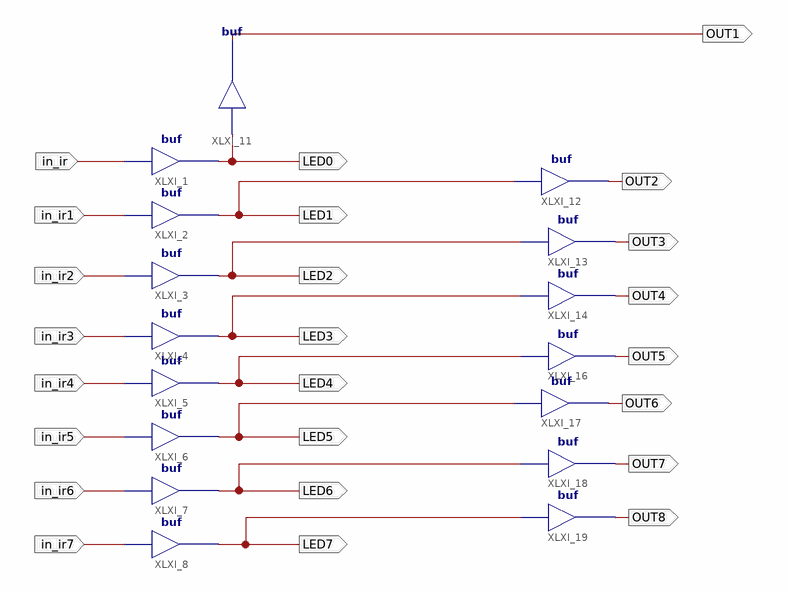
[diagram p0: schematic sheet 1]
// Xilinx ISE schematic fpga.sch (spartan6) as structural Verilog: 16 symbols, 24 ports
module fpga (
  input  in_ir,
  input  in_ir1,
  input  in_ir2,
  input  in_ir3,
  input  in_ir4,
  input  in_ir5,
  input  in_ir6,
  input  in_ir7,
  output LED0,
  output LED1,
  output LED2,
  output LED3,
  output LED4,
  output LED5,
  output LED6,
  output LED7,
  output OUT1,
  output OUT2,
  output OUT3,
  output OUT4,
  output OUT5,
  output OUT6,
  output OUT7,
  output OUT8
);

  buf XLXI_1 (LED0, in_ir);
  buf XLXI_2 (LED1, in_ir1);
  buf XLXI_3 (LED2, in_ir2);
  buf XLXI_4 (LED3, in_ir3);
  buf XLXI_5 (LED4, in_ir4);
  buf XLXI_6 (LED5, in_ir5);
  buf XLXI_7 (LED6, in_ir6);
  buf XLXI_8 (LED7, in_ir7);
  buf XLXI_11 (OUT1, LED0);
  buf XLXI_12 (OUT2, LED1);
  buf XLXI_13 (OUT3, LED2);
  buf XLXI_14 (OUT4, LED3);
  buf XLXI_16 (OUT5, LED4);
  buf XLXI_17 (OUT6, LED5);
  buf XLXI_18 (OUT7, LED6);
  buf XLXI_19 (OUT8, LED7);
endmodule
